# EAGLE schematic smart-servo-addon-board v52 (EAGLE 9.7.0)
Assembly variants: Insurance
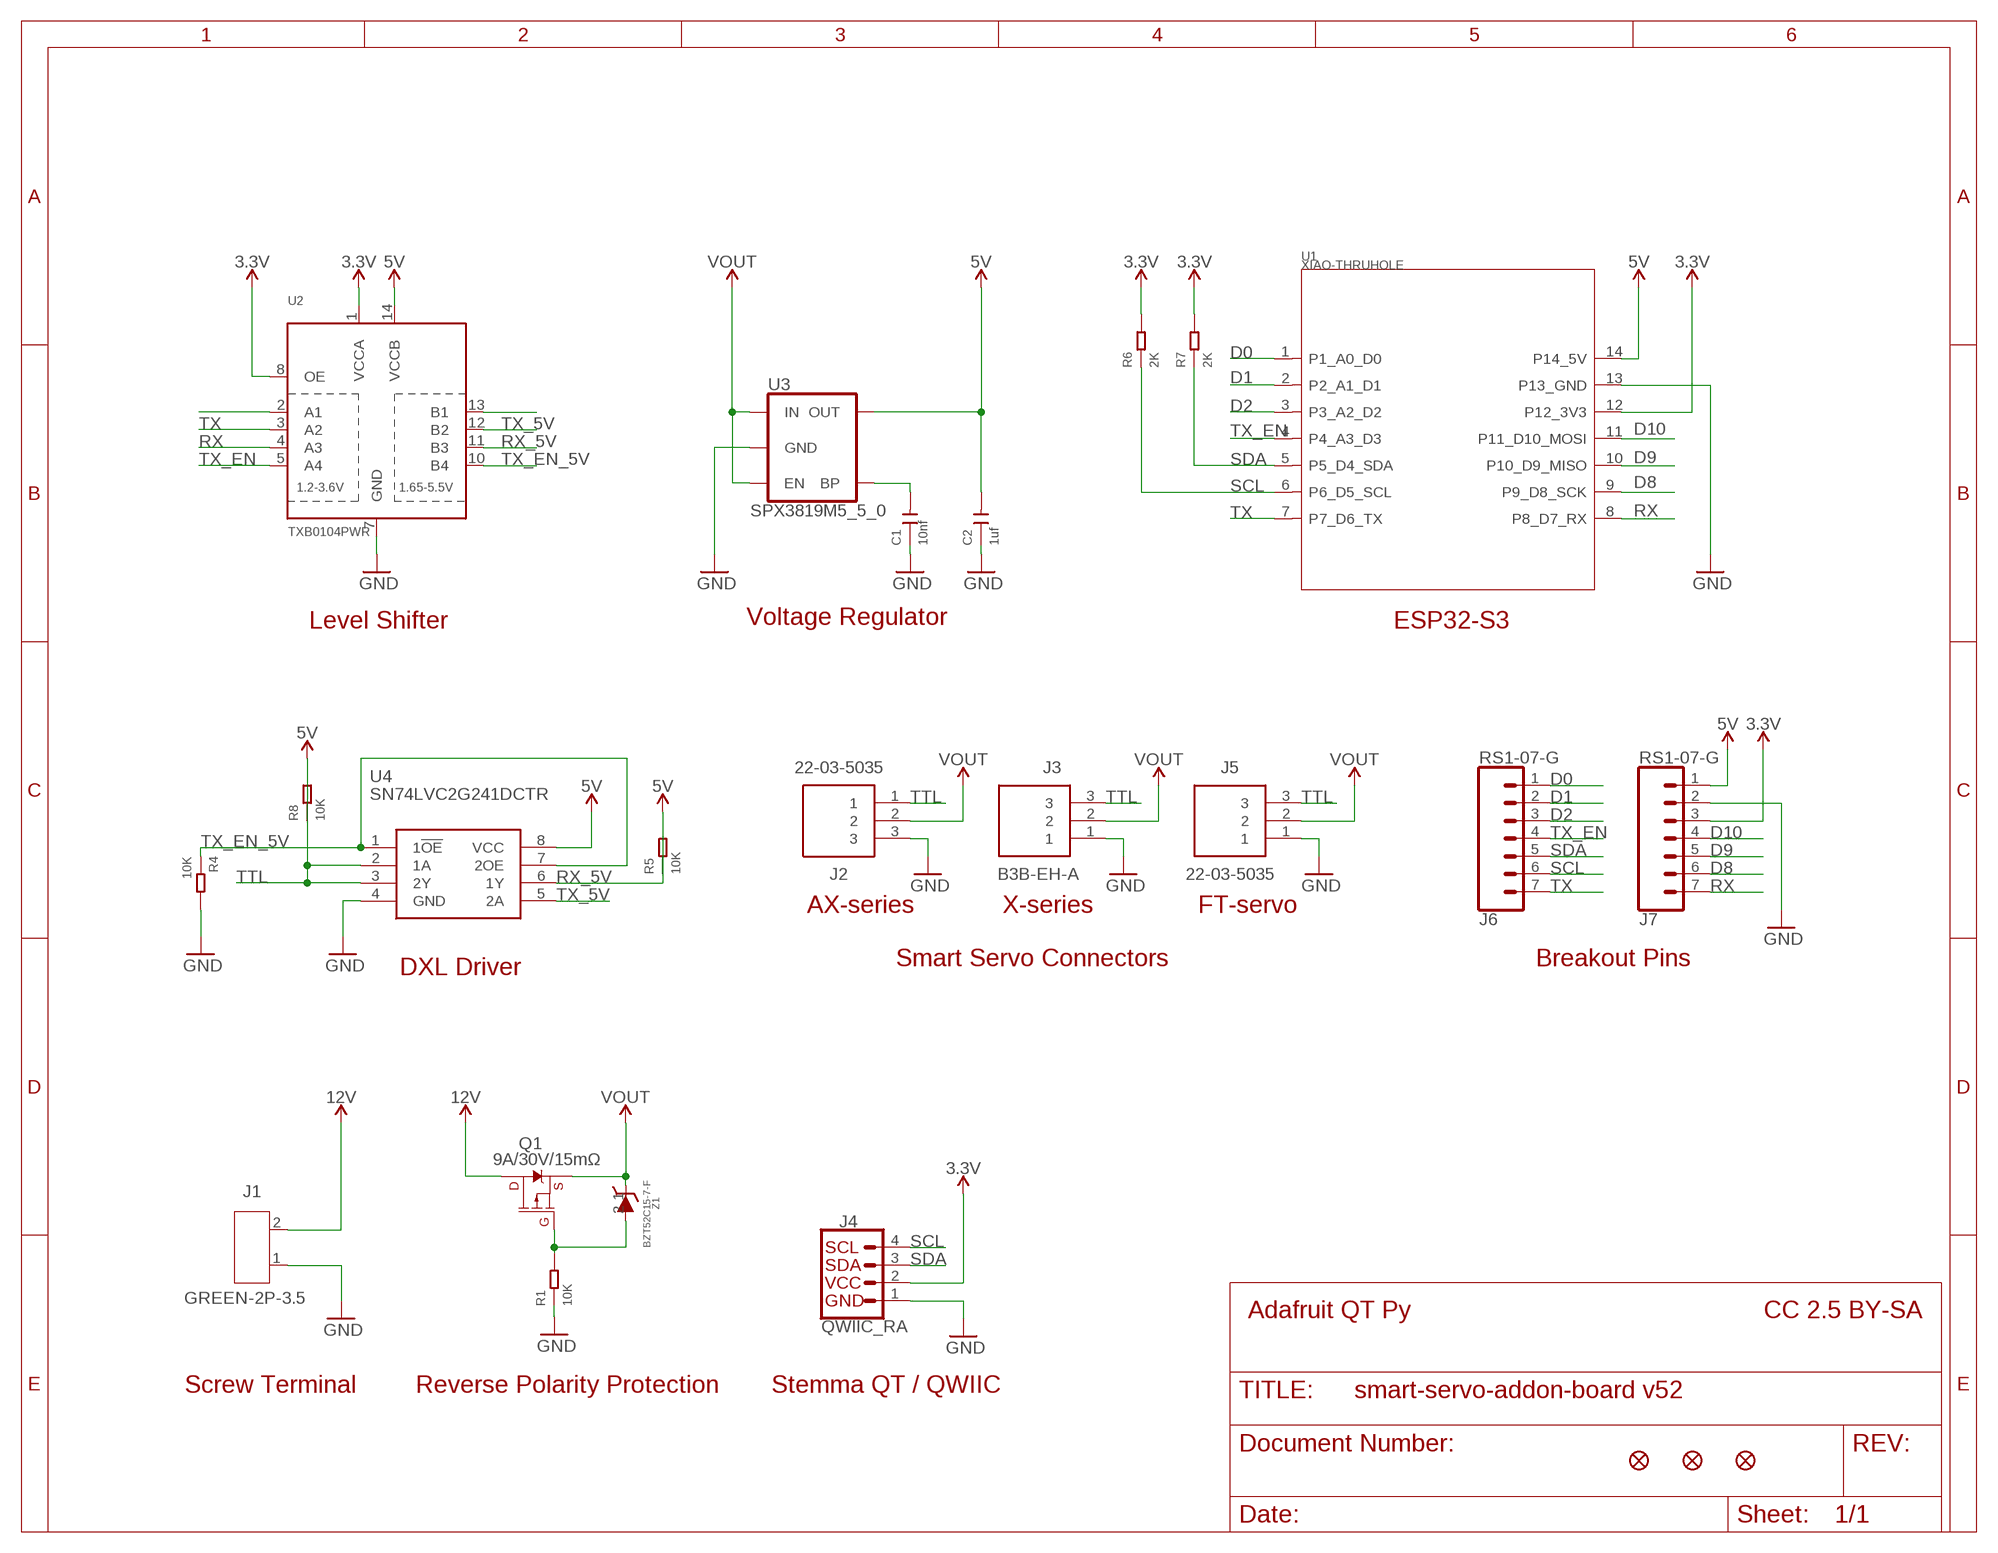
[diagram p0: schematic, sheet 1]

## Parts
C1  10nf  CERAMIC-10NF-50V-10%-X7R(0603)  [C0603]
C2  1uf  CERAMIC-1UF-25V-10%-X7R(0603)  [C0603]
FD4  FIDUCIAL""  [FIDUCIAL_1MM]
FD5  FIDUCIAL""  [FIDUCIAL_1MM]
FD6  FIDUCIAL""  [FIDUCIAL_1MM]
J1  GREEN-2P-3.5  SCREW-TERMINAL-GREEN(2P-3.5)  [H2-3.5-7.0X7.0MM]
J2  22-03-5035  [SHDR3W60P0X250_1X3_990X490X590]
J3  B3B-EH-A  [SHDR3W64P0X250_1X3_1000X380X60]
J4  QWIIC_RA  QWIIC_CONNECTORJS-1MM  [JST04_1MM_RA]
J5  22-03-5035  [SHDR3W60P0X250_1X3_990X490X590]
J6  RS1-07-G  CONN_07  [1X07]
J7  RS1-07-G  CONN_07  [1X07]
Q1  9A/30V/15mΩ  MOSFET_PCH-STL9P3LLH6  [8-POWERVDFN-3X3]
R1  10K  SMD-RES-10K-1%-1/10W(0603)  [R0603]
R4  10K  SMD-RES-10K-1%-1/10W(0603)  [R0603]
R5  10K  SMD-RES-10K-1%-1/10W(0603)  [R0603]
R6  2K  SMD-RES-10K-1%-1/10W(0603)  [R0603]
R7  2K  SMD-RES-10K-1%-1/10W(0603)  [R0603]
R8  10K  SMD-RES-10K-1%-1/10W(0603)  [R0603]
U1  XIAO-THRUHOLE  [XIAO-GENERIC-THRUHOLE-MODULE14P-2.54-21X17.8MM]
U2  TXB0104PWR  [TSSOP14]
U3  SPX3819M5_5_0  V_REG_SPX3819-SOT23-5  [SOT23-5]
U4  SN74LVC2G241DCTR  [SOP65P400X130-8N]
Z1  BZT52C15-7-F  [SOD3716X145N]

## Nets
3.3V: J4.2 J7.3 R6.2 R7.2 U1.12(P12_3V3) U2.1(VCCA) U2.8(OE)
5V: C2.2 J7.1 R5.1 R8.1 U1.14(P14_5V) U2.14(VCCB) U3.5(OUT) U4.8(VCC)
12V: J1.2 Q1.5@1(D) Q1.5@2(D) Q1.5@3(D)
D0: J6.1 U1.1(P1_A0_D0)
D1: J6.2 U1.2(P2_A1_D1)
D2: J6.3 U1.3(P3_A2_D2)
D8: J7.6 U1.9(P9_D8_SCK)
D9: J7.5 U1.10(P10_D9_MISO)
D10: J7.4 U1.11(P11_D10_MOSI)
GND: C1.1 C2.1 J1.1 J2.3 J3.1 J4.1 J5.1 J7.2 R1.1 R4.2 U1.13(P13_GND) U2.7(GND) U3.2(GND) U4.4(GND)
N$1: U2.13(B1)
N$2: C1.2 U3.4(BP)
N$4: U2.2(A1)
N$5: Q1.4(G) R1.2 Z1.2(A)
RX: J7.7 U1.8(P8_D7_RX) U2.4(A3)
RX_5V: R5.2 U2.11(B3) U4.6(1Y)
SCL: J4.4 J6.6 R6.1 U1.6(P6_D5_SCL)
SDA: J4.3 J6.5 R7.1 U1.5(P5_D4_SDA)
TTL: J2.1 J3.3 J5.3 R8.2 U4.2(1A) U4.3(2Y)
TX: J6.7 U1.7(P7_D6_TX) U2.3(A2)
TX_5V: U2.12(B2) U4.5(2A)
TX_EN: J6.4 U1.4(P4_A3_D3) U2.5(A4)
TX_EN_5V: R4.1 U2.10(B4) U4.1(1!OE) U4.7(2OE)
VOUT: J2.2 J3.2 J5.2 Q1.1(S) Q1.2(S) Q1.3(S) U3.1(IN) U3.3(EN) Z1.1(K)

## Notes on the sheet
- Level Shifter | Voltage Regulator | ESP32-S3
- AX-series | X-series | FT-servo
- Smart Servo Connectors | Breakout Pins
- DXL Driver
- Adafruit QT Py | CC 2.5 BY-SA
- Screw Terminal | Reverse Polarity Protection | Stemma QT / QWIIC

## Library data of the parts
C1 = OPL_Capacitor:CERAMIC-10NF-50V-10%-X7R(0603): 302010140; MPN: CC0603KRX7R9BB103
C2 = OPL_Capacitor:CERAMIC-1UF-25V-10%-X7R(0603): 302010139; MPN: CC0603KRX7R8BB105
FD4-FD6 = Airquality_Sensor:FIDUCIAL: Fiducial Alignment Points Various fiducial points for machine vision alignment.; BOM: EXCLUDE
J1 = OPL_Connector:SCREW-TERMINAL-GREEN(2P-3.5): 320110028
J2 J5 = molex-22-03-5035:22-03-5035: Header 2.5mm SPOX,WTB,vert, shrouded, 3w Molex SPOX Series, Series Number 5267, 2.5mm Pitch 3 Way 1 Row Straight PCB Header, Solder Termination, 3A Source: Datasheet <http://www.molex.com/pdm_docs/sd/022035035_sd.pdf>; DESCRIPTION: Header 2.5mm SPOX,WTB,vert, shrouded, 3w Molex SPOX Series, Series Number 5267, 2.5mm Pitch 3 Way 1 Row Straight PCB Header, Solder Termination, 3A; HEIGHT: 5.9mm; MANUFACTURER_NAME: Molex; MANUFACTURER_PART_NUMBER: 22-03-5035; MOUSER_PART_NUMBER: 538-22-03-5035; MOUSER_PRICE-STOCK: https://www.mouser.co.uk/ProductDetail/Molex/22-03-5035?qs=VKrXD49J9Ep%252Bv2WwbOoiPA%3D%3D
J3 = B3B-EH-A:B3B-EH-A: CONN HEADER VERT 3POS 2.5MM Source: Datasheet <https://datasheet.datasheetarchive.com/originals/dk/DKDS-2/32954.pdf>; DESCRIPTION: CONN HEADER VERT 3POS 2.5MM; HEIGHT: 6mm; MANUFACTURER_NAME: JST (JAPAN SOLDERLESS TERMINALS); MANUFACTURER_PART_NUMBER: B3B-EH-A
J4 = SparkFun-Connectors:QWIIC_CONNECTOR: SparkFun I2C Standard Qwiic Connector An SMD 1mm pitch JST connector makes it easy and quick (get it? Qwiic?) to connect I2C devices to each other. The Qwiic system <http://www.sparkfun.com/qwiic> enables fast and solderless connection between popular platforms and various sensors and actuators. We carry 200mm <https://www.sparkfun.com/products/14204>, 100mm <https://www.sparkfun.com/products/14205>, 50mm <https://www.sparkfun.com/products/14206>, and breadboard friendly <https://www.sparkfun.com/products/14207> Qwiic cables. We also offer 10 pcs strips <https://www.sparkfun.com/products/14323> the SMD connectors.; PROD_ID: CONN-13694; VALUE: QWIIC_RIGHT_ANGLE
J6 J7 = SparkFun-Connectors:CONN_07: Multi connection point. Often used as Generic Header-pin footprint for 0.1 inch spaced/style header connections On any of the 0.1 inch spaced packages, you can populate with these: Break Away Headers - Straight <https://www.sparkfun.com/products/116> (PRT-00116) Break Away Male Headers - Right Angle <https://www.sparkfun.com/products/553> (PRT-00553) Female Headers <https://www.sparkfun.com/products/115> (PRT-00115) Break Away Headers - Machine Pin <https://www.sparkfun.com/products/117> (PRT-00117) Break Away Female Headers - Swiss Machine Pin <https://www.sparkfun.com/products/743> (PRT-00743) For SCREWTERMINALS and SPRING TERMINALS visit here: Screw Terimnals on SparkFun.com <https://www.sparkfun.com/search/results?term=Screw+Terminals> (5mm/3.5mm/2.54mm spacing) This device is also useful as a general connection point to wire up your design to another part of your project. Our various solder wires solder well into these plated through hole pads. Hook-Up Wire - Assortment (Stranded, 22 AWG) <https://www.sparkfun.com/products/11375> (PRT-11375) Hook-Up Wire - Assortment (Solid Core, 22 AWG) <https://www.sparkfun.com/products/11367> (PRT-11367) View the entire wire category on our website here <https://www.sparkfun.com/categories/141> Special notes: Molex polarized connector foot print use with SKU : PRT-08231 with associated crimp pins and housings. 1MM SMD Version SKU: PRT-10208 NOTES ON THE VARIANTS LOCK and LOCK_LONGPADS... This footprint was designed to help hold the alignment of a through-hole component (i.e. 6-pin header) while soldering it into place. You may notice that each hole has been shifted either up or down by 0.005 of an inch from it's more standard position (which is a perfectly straight line). This slight alteration caused the pins (the squares in the middle) to touch the edges of the holes. Because they are alternating, it causes a "brace" to hold the component in place. 0.005 has proven to be the perfect amount of "off-center" position when using our standard breakaway headers. Although looks a little odd when you look at the bare footprint, once you have a header in there, the alteration is very hard to notice. Also,if you push a header all the way into place, it is covered up entirely on the bottom side.
Q1 = SparkFun-DiscreteSemi:MOSFET_PCH: P-channel MOSFETs Voltage controlled devices that allow control of high current outputs. SparkFun Products: SparkFun ESP32 Thing <https://www.sparkfun.com/products/13907> SparkFun ESP8266 Thing <https://www.sparkfun.com/products/13231> SparkFun Pi Servo HAT V2 <https://www.sparkfun.com/products/15316> DMG2305UX-7 (20V/4.2A/SOT23-3); PROD_ID: TRANS-14715
R1 R4 R5 R8 = OPL_Resistor:SMD-RES-10K-1%-1/10W(0603): 301011970; MPN: RC0603FR-0710KL
R6 R7 = OPL_Resistor:SMD-RES-10K-1%-1/10W(0603): 301011970; MPN: RC0603FR-0710KL; VALUE: 10K
U1 = Seeed Studio XIAO Series:XIAO-THRUHOLE: Seeed Studio XIAO Series Through-hole Footprint and Symbol Basic through-hole footprint for Seeed XIAO series of boards. The underside surface mount pads are disabled. For through-hole mounting, a pair of 7-pin, 2.54mm pitch headers with 0.64x0.64mm square leads are recommended. The hybrid variant allows the assembler to choose between surface mount and through-hole mounting methods. However, there is a risk of solder leakage and therefore insufficient solder at the joints if soldering using solder paste and stencils, so we advise using this footprint only when the module is intended to be hand soldered. The symbol pin labels are generic. Please refer to the specific board for more information. Seeed Studio XIAO SAMD21 (Seeeduino XIAO) is also available pre-soldered: Seeed Studio XIAO SAMD21 Pre-soldered - Microchip ATSAMD21G18 Arduino Microcontroller with headers Seeed SKU: 102010388 Buy now <https://www.seeedstudio.com/Seeeduino-XIAO-Pre-Soldered-p-4747.html>
U2 = adafruit:TXB0104PWR: 4-Bit Bi-Directional Level Shifter 1.2V-3.6V (VCCA) to 1.65V-5.5V (VCCB) bi-directional level shifter with auto direction sensing. Max data rate - VCCA 1.8V: 20Mbps (50ns), VCCA 3.3V: 100Mbps (10ns) Digikey: 296-21929-1-ND
U3 = SparkFun-IC-Power:V_REG_SPX3819: SPX3819 Voltage Regulator 3.3V 500mA, 16V input Datasheet <https://www.exar.com/content/document.ashx?id=22106> SparkFun Products: SparkFun Serial Controlled Motor Driver <https://www.sparkfun.com/products/13911>; PROD_ID: VREG-13321; VALUE: SPX3819M5_3_3
U4 = SN74LVC2G241DCTR:SN74LVC2G241DCTR: Dual Buffer/Driver With 3-State Outputs Source: Datasheet <http://www.ti.com/lit/gpn/sn74lvc2g241>; DESCRIPTION: Dual Buffer/Driver With 3-State Outputs; HEIGHT: 1.3mm; MANUFACTURER_NAME: Texas Instruments; MANUFACTURER_PART_NUMBER: SN74LVC2G241DCTR; MOUSER_PART_NUMBER: 595-SN74LVC2G241DCTR; MOUSER_PRICE-STOCK: https://www.mouser.co.uk/ProductDetail/Texas-Instruments/SN74LVC2G241DCTR?qs=FetendrIl6uh8lISnOsUbw%3D%3D
Z1 = BZT52C15-7-F:BZT52C15-7-F: Zener Diodes 500mW 15V Zener AEC-Q101 Qualified Source: Datasheet <https://www.diodes.com//assets/Datasheets/ds18004.pdf>; ARROW_PART_NUMBER: BZT52C15-7-F; ARROW_PRICE-STOCK: https://www.arrow.com/en/products/bzt52c15-7-f/diodes-incorporated?region=europe; DESCRIPTION: Zener Diodes 500mW 15V Zener AEC-Q101 Qualified; HEIGHT: 1.45mm; MANUFACTURER_NAME: Diodes Incorporated; MANUFACTURER_PART_NUMBER: BZT52C15-7-F; MOUSER_PART_NUMBER: 621-BZT52C15-F; MOUSER_PRICE-STOCK: https://www.mouser.co.uk/ProductDetail/Diodes-Incorporated/BZT52C15-7-F?qs=Zq5ylnUbLm6eEGp7%2FW8GPQ%3D%3D